# Altium schematic sheet Sheet1.SchDoc
size A3
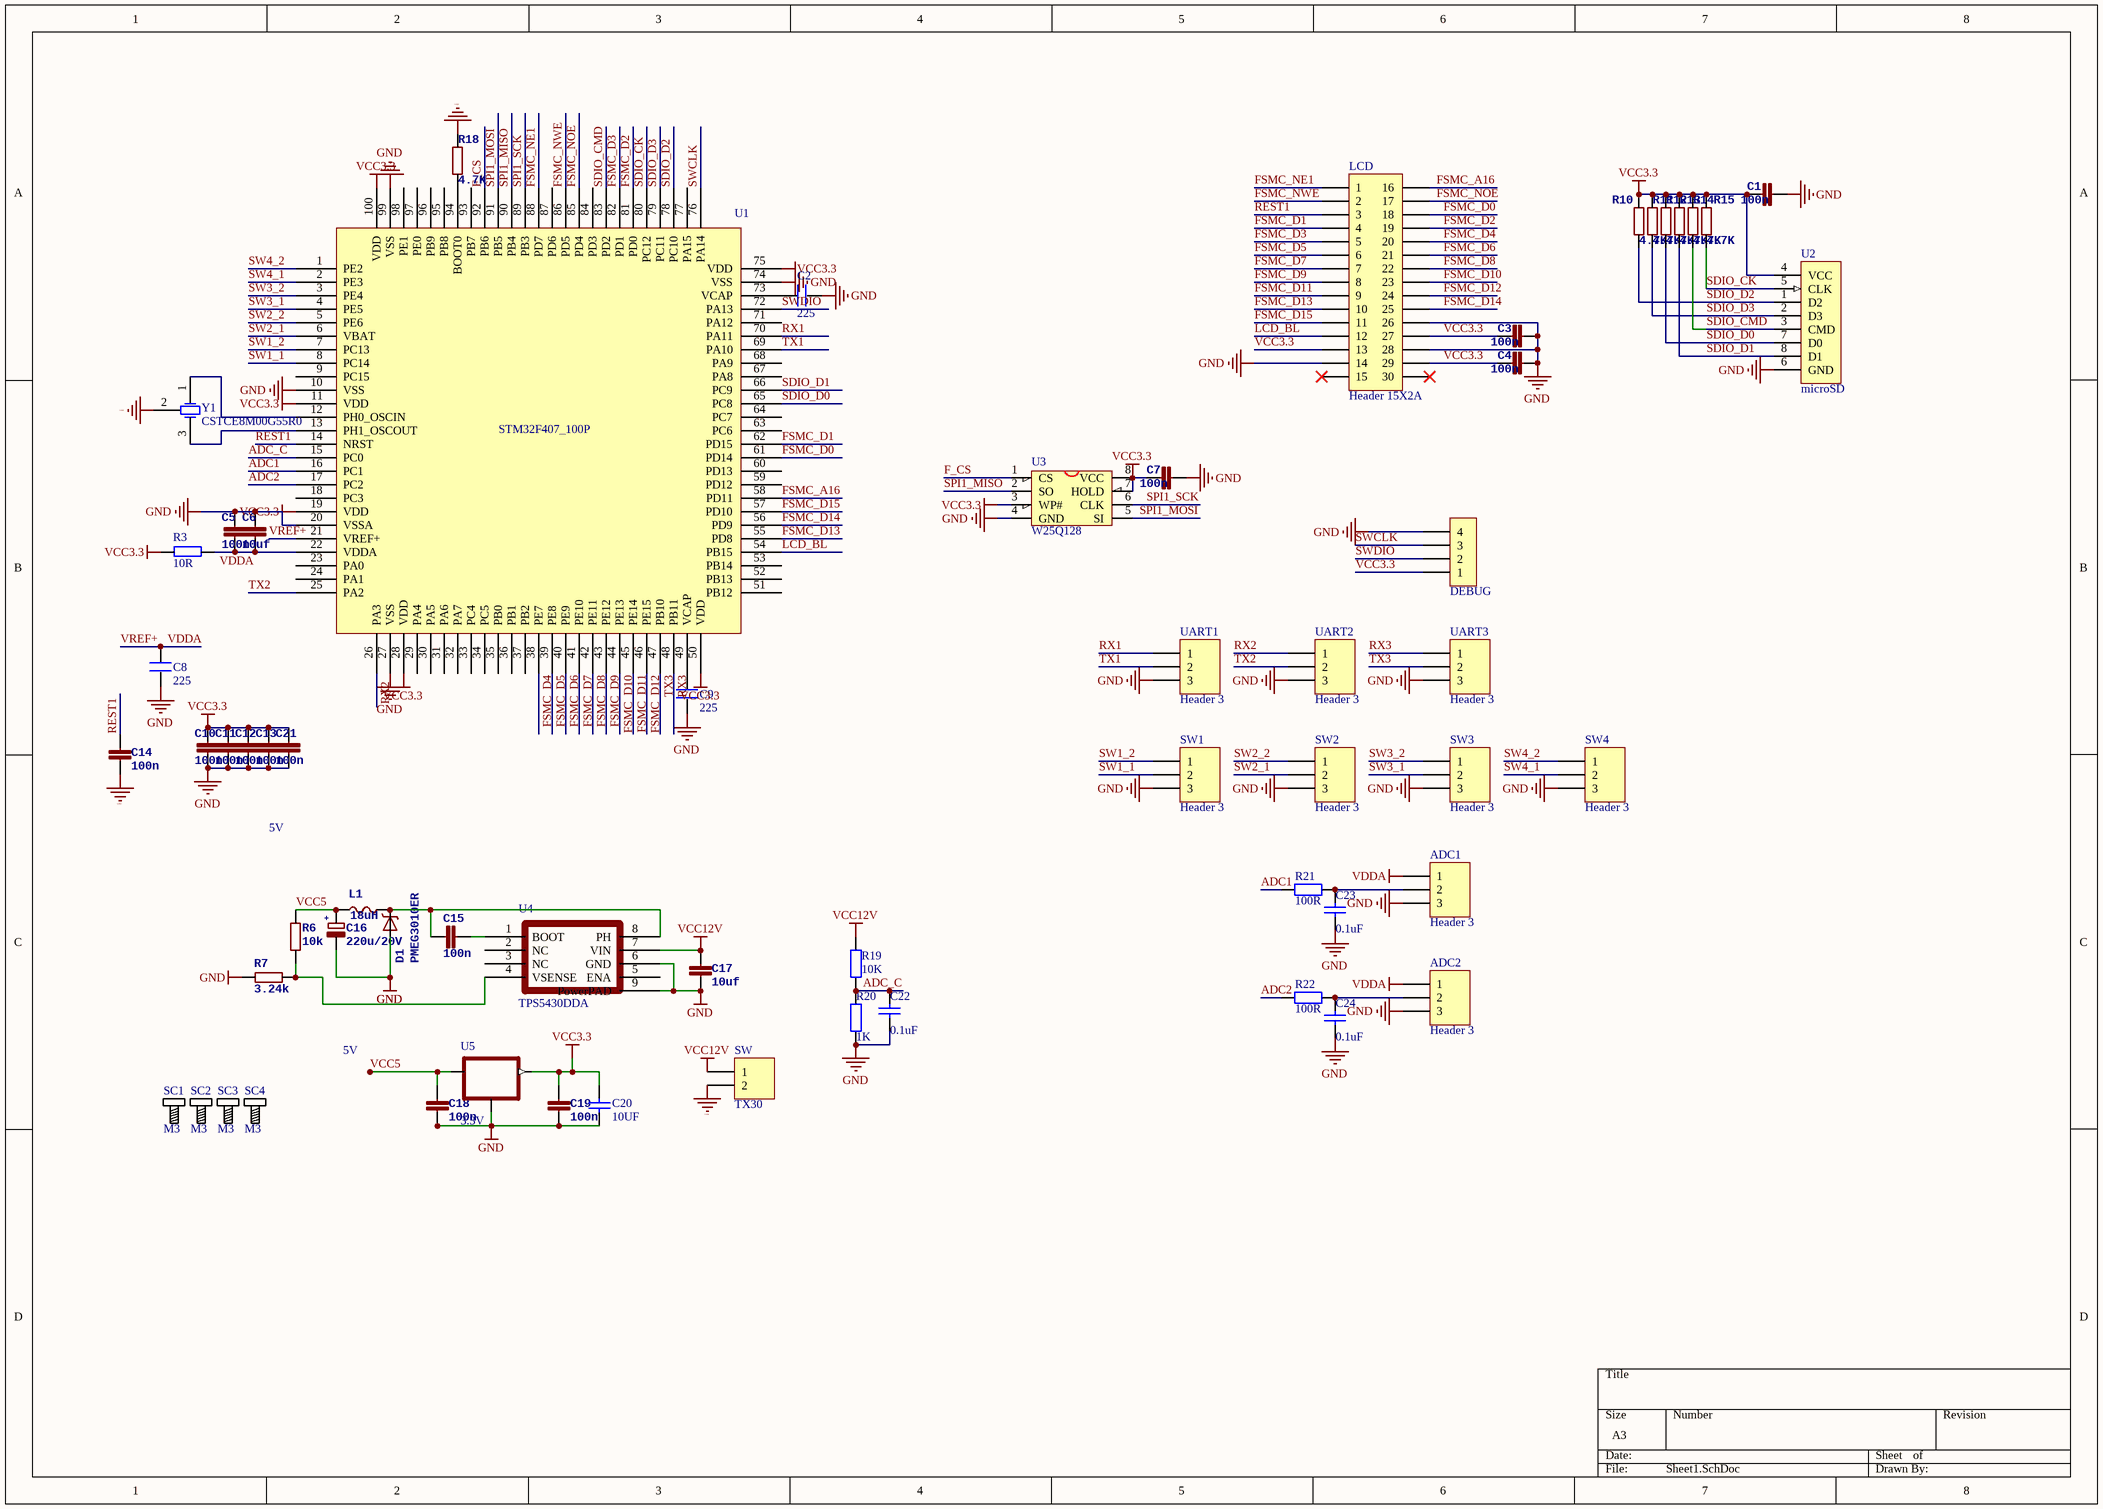
[diagram p0: Sheet1.SchDoc]

## Parts
ADC1  Header 3  [3PJST1.25]
ADC2  Header 3  [3PJST1.25]
C1  100n  [C0603]
C2  225  [C0603]
C3  100n  [C0603]
C4  100n  [C0603]
C5  100n  [C0603]
C6  10uf  [C0603]
C7  100n  [C0603]
C8  225  [C0603]
C9  225  [C0603]
C10  100n  [C0603]
C11  100n  [C0603]
C12  100n  [C0603]
C13  100n  [C0603]
C14  100n  [C0603]
C15  100n  [C0603]
C16  220u/20V  [SMC_B]
C17  10uf  [C0603]
C18  100n  [C0603]
C19  100n  [C0603]
C20  10UF  [C0603]
C21  100n  [C0603]
C22  0.1uF  [C0603]
C23  0.1uF  [C0603]
C24  0.1uF  [C0603]
D1  PMEG3010ER  [SOD123W-DIODE - AK]
DEBUG  CON4  [DF13-1.25-4A]  (value not drawn)
L1  18uH  [L7_7_4]
LCD  Header 15X2A  [DIP1.0X30]
R3  10R  [R0603]
R6  10k  [R0603]
R7  3.24k  [R0603]
R10  4.7K  [R0603]
R11  4.7K  [R0603]
R12  4.7K  [R0603]
R13  4.7K  [R0603]
R14  4.7K  [R0603]
R15  4.7K  [R0603]
R18  4.7K  [R0603]
R19  10K  [R0603]
R20  value 1K  [R0603]  (hidden comment: 10K)
R21  value 100R  [R0603]  (hidden comment: 10K)
R22  value 100R  [R0603]  (hidden comment: 10K)
SC1  M3  [SCRREW_M3]
SC2  M3  [SCRREW_M3]
SC3  M3  [SCRREW_M3]
SC4  M3  [SCRREW_M3]
SW  TX30  [TX30-m]
SW1  Header 3  [3PJST1.25]
SW2  Header 3  [3PJST1.25]
SW3  Header 3  [3PJST1.25]
SW4  Header 3  [3PJST1.25]
U1  STM32F407_100P  [ST_LQFP100]
U2  microSD  [MICROSD1]
U3  W25Q128  [SOIC-8]
U4  TPS5430DDA  [SOIC]
U5  3.3V  [SOT23]
UART1  Header 3  [3PJST1.25]
UART2  Header 3  [3PJST1.25]
UART3  Header 3  [3PJST1.25]
Y1  CSTCE8M00G55R0  [CRYSMD3.2X1.3]

## Nets
GND: ADC1.3 ADC2.3 C1.2 C2.1 C3.2 C4.2 C5.2 C6.2 C7.2 C8.2 C9.1 C10.1 C11.1 C12.1 C13.1 C14.1 C16.- C17.2 C18.2 C19.2 C20.1 C21.1 C22.1 C23.1 C24.1 D1.A DEBUG.4 LCD.14 LCD.26 LCD.28 R7.2 R18.2 R20.2 SW.2 SW1.3 SW2.3 SW3.3 SW4.3 U1.10(VSS) U1.20(VSSA) U1.27(VSS) U1.74(VSS) U1.99(VSS) U2.6(GND) U3.4(GND) U4.6(GND) U4.9(PowerPAD) U5.1(GND) UART1.3 UART2.3 UART3.3 Y1.2(GND)
VCC3.3: C1.1 C3.1 C4.1 C7.1 C10.2 C11.2 C12.2 C13.2 C19.1 C20.2 C21.2 DEBUG.1 LCD.13 LCD.27 LCD.29 R3.2 R10.2 R11.2 R12.2 R13.2 R14.2 R15.2 U1.11(VDD) U1.19(VDD) U1.28(VDD) U1.50(VDD) U1.75(VDD) U1.100(VDD) U2.4(VCC) U3.3(WP#) U3.7(HOLD) U3.8(VCC) U5.2(OUT)
VCC12V: C17.1 R19.1 SW.1 U4.7(VIN)
VDDA: ADC1.1 ADC2.1 C5.1 C6.1 C8.1 R3.1 U1.21(VREF+) U1.22(VDDA)  [also labelled VREF+]
ADC1: R21.1 U1.16(PC1)
ADC2: R22.1 U1.17(PC2)
ADC_C: C22.2 R19.2 R20.1 U1.15(PC0)
F_CS: U1.92(PB6) U3.1(CS)
FSMC_A16: LCD.16 U1.58(PD11)
FSMC_D0: LCD.18 U1.61(PD14)
FSMC_D1: LCD.4 U1.62(PD15)
FSMC_D2: LCD.19 U1.81(PD0)
FSMC_D3: LCD.5 U1.82(PD1)
FSMC_D4: LCD.20 U1.38(PE7)
FSMC_D5: LCD.6 U1.39(PE8)
FSMC_D6: LCD.21 U1.40(PE9)
FSMC_D7: LCD.7 U1.41(PE10)
FSMC_D8: LCD.22 U1.42(PE11)
FSMC_D9: LCD.8 U1.43(PE12)
FSMC_D10: LCD.23 U1.44(PE13)
FSMC_D11: LCD.9 U1.45(PE14)
FSMC_D12: LCD.24 U1.46(PE15)
FSMC_D13: LCD.10 U1.55(PD8)
FSMC_D14: LCD.25 U1.56(PD9)
FSMC_D15: LCD.11 U1.57(PD10)
FSMC_NE1: LCD.1 U1.88(PD7)
FSMC_NOE: LCD.17 U1.85(PD4)
FSMC_NWE: LCD.2 U1.86(PD5)
LCD_BL: LCD.12 U1.54(PB15)
REST1: C14.2 LCD.3 U1.14(NRST)
RX1: U1.70(PA11) UART1.1
RX2: U1.26(PA3) UART2.1
RX3: U1.48(PB11) UART3.1
SDIO_CK: R15.1 U1.80(PC12) U2.5(CLK)
SDIO_CMD: R14.1 U1.83(PD2) U2.3(CMD)
SDIO_D0: R12.1 U1.65(PC8) U2.7(D0)
SDIO_D1: R13.1 U1.66(PC9) U2.8(D1)
SDIO_D2: R10.1 U1.78(PC10) U2.1(D2)
SDIO_D3: R11.1 U1.79(PC11) U2.2(D3)
SPI1_MISO: U1.90(PB4) U3.2(SO)
SPI1_MOSI: U1.91(PB5) U3.5(SI)
SPI1_SCK: U1.89(PB3) U3.6(CLK)
SW1_1: SW1.2 U1.8(PC14)
SW1_2: SW1.1 U1.7(PC13)
SW2_1: SW2.2 U1.6(VBAT)
SW2_2: SW2.1 U1.5(PE6)
SW3_1: SW3.2 U1.4(PE5)
SW3_2: SW3.1 U1.3(PE4)
SW4_1: SW4.2 U1.2(PE3)
SW4_2: SW4.1 U1.1(PE2)
SWCLK: DEBUG.3 U1.76(PA14)
SWDIO: DEBUG.2 U1.72(PA13)
TX1: U1.69(PA10) UART1.2
TX2: U1.25(PA2) UART2.2
TX3: U1.47(PB10) UART3.2
VCC5: C16.+ C18.1 L1.1 R6.2 U5.3(IN)
NetADC1_2: ADC1.2 C23.2 R21.2
NetADC2_2: ADC2.2 C24.2 R22.2
NetC2_2: C2.2 U1.73(VCAP)
NetC9_2: C9.2 U1.49(VCAP)
NetC15_1: C15.1 D1.K L1.2 U4.8(PH)
NetC15_2: C15.2 U4.1(BOOT)
NetR6_1: R6.1 R7.1 U4.4(VSENSE)
NetR18_1: R18.1 U1.94(BOOT0)
NetU1_12: U1.12(PH0_OSCIN) Y1.1(OSC1)
NetU1_13: U1.13(PH1_OSCOUT) Y1.3(OSC2)

Not connected (* = marked no-connect by the designer): LCD 15* 30*; U1 9(PC15) 18(PC3) 23(PA0) 24(PA1) 29(PA4) 30(PA5) 31(PA6) 32(PA7) 33(PC4) 34(PC5) 35(PB0) 36(PB1) 37(PB2) 51(PB12) 52(PB13) 53(PB14) 59(PD12) 60(PD13) 63(PC6) 64(PC7) 67(PA8) 68(PA9) 71(PA12) 77(PA15) 84(PD3) 87(PD6) 93(PB7) 95(PB8) 96(PB9) 97(PE0) 98(PE1); U4 2(NC) 3(NC) 5(ENA)

## Notes on the sheet
- 5V

## Library data of the parts
ADC1 ADC2 SW1-SW4 UART1-UART3 = Header 3: Header, 3-Pin; LatestRevisionDate: 17-Jul-2002; LatestRevisionNote: Re-released for DXP Platform.; Publisher: Altium Limited
C1 C3-C7 C10-C15 C17-C19 C21 = C-EUC0603: CAPACITOR, European symbol
C2 C8 C9 = C
C16 = CPOL-EUSMCB: POLARIZED CAPACITOR, European symbol; +: +
C20 C22-C24 = Cap: Capacitor; Published: 8-Jun-2000; LatestRevisionDate: 17-Jul-2002; LatestRevisionNote: Re-released for DXP Platform.; PackageReference: RAD-0.3; Publisher: Altium Limited
  C20: Value: 10UF
  C22-C24: Value: 0.1uF
D1 = DIODE-SCHOTTKYSOD123-W
L1 = L-EU_L0603
LCD = Header 15X2A: Header, 15-Pin, Dual row; LatestRevisionDate: 17-Jul-2002; LatestRevisionNote: Re-released for DXP Platform.; Publisher: Altium Limited
R3 = R
R6 R7 R10-R15 R18 = R-EU_R0603: RESISTOR, European symbol
R19-R22 = Res2: Resistor; Published: 8-Jun-2000; LatestRevisionDate: 17-Jul-2002; LatestRevisionNote: Re-released for DXP Platform.; PackageReference: AXIAL-0.4; Publisher: Altium Limited
  R19: Value: 10K
SC1-SC4 = Screw_M3: Screw
SW = Header 2: Header, 2-Pin; LatestRevisionDate: 17-Jul-2002; LatestRevisionNote: Re-released for DXP Platform.; Publisher: Altium Limited
U3 = W25X16: W25X16;SST25VF016;MX25L1605
U5 = XC6206
Y1 = XTAL-3